# Altium project Can_Bus.PrjPcb
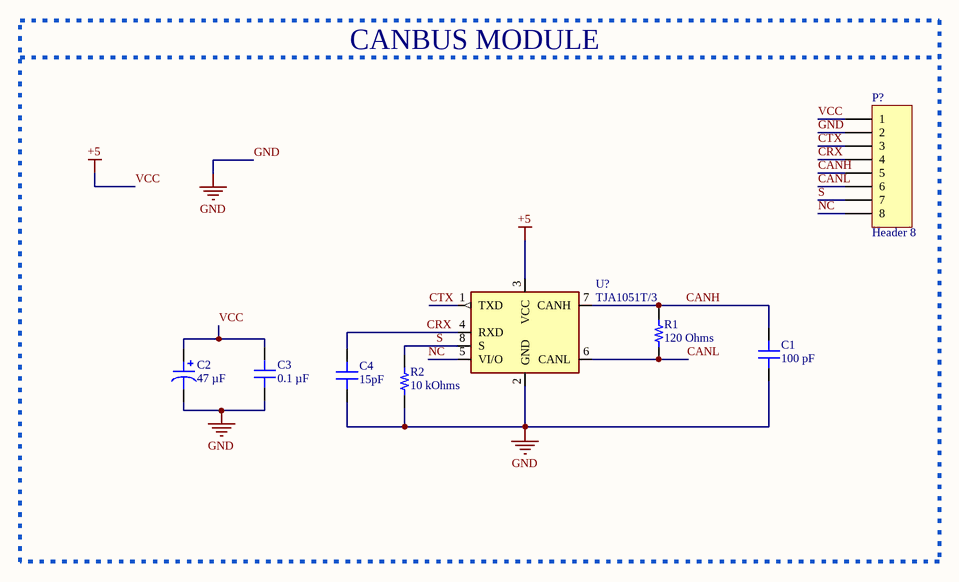
[diagram p0: Can_Bus.SchDoc]
1 sheet, 8 parts. Net scope: global (net labels, ports and power ports of the same name join across sheets).
Board file: Can_Bus.PcbDoc

## Sheet Can_Bus.SchDoc
size A4; SheetNumber: 1; SheetTotal: 1

### Parts
C1  100 pF  [CAP 0805_2012]
C2  47 µF  [CAP POL 1411_3528]
C3  0.1 µF  [CAP 0805_2012]
C4  15pF  [CAP 0805_2012]
P?  Header 8  [HDR1X8]
R1  120 Ohms  [RES 0805_2012]
R2  10 kOhms  [RES 0805_2012]
U?  TJA1051T/3  [SOT96-1]

### Blocks framed on the sheet
CANBUS MODULE: C1-C4 P? R1 R2 U?

### Nets
GND: C1.1 C2.2 C3.1 C4.1 P?.2 R2.1 U?.2(GND)
VCC: C2.1 C3.2 P?.1 U?.3(VCC)  [also labelled +5]
CANH: C1.2 P?.5 R1.2 U?.7(CANH)
CANL: P?.6 R1.1 U?.6(CANL)
CRX: C4.2 P?.4 U?.4(RXD)
CTX: P?.3 U?.1(TXD)
NC: P?.8 U?.5(VI/O)
S: P?.7 R2.2 U?.8(S)

### Library data of the parts
C1 = C0805C101J5HACAUTO: CAP CER 0805 100PF 50V ULTRA STA; manufacturer: KEMET; Temperature Coefficient: X8R; Tolerance: ±5%; Part Number: C0805C101J5HACAUTO; Value: 100 pF; Applications: Automotive; Capacitance: 100 pF; componentlink1description: Datasheet; componentlink1url: https://api.kemet.com/component-edge/download/datasheet/C0805C101J5HACAUTO.pdf; componentlink2description: DigiKey Link; componentlink2url: https://www.digikey.com/en/products/detail/kemet/C0805C101J5HACAUTO/7943626; Device Package: 0805 (2012 Metric); Features: Low ESL, High Temperature; lastupdated: 9.02.2024 20:16:09; Lifecycle Status: Active; Minimum Order: 1; Mounting Type: Surface Mount, MLCC; Operating Temperature: -55°C ~ 150°C; Package / Case: 0805 (2012 Metric); packaging: TapeAndReel; partid: 2585; Part Status: Active; price: 0.01; Ratings: AEC-Q200; series: SMD Auto X8R HT150C; Size / Dimension: 0.079" L x 0.049" W (2.00mm x 1.25mm); Supplier 1: DigiKey; Supplier Part Number 1: 399-16585-1-ND; Thickness (Max): 0.035" (0.88mm); Voltage - Rated: 50V
C2 = T494B476K010AT: CAP TANT 47UF 10% 10V 1411; manufacturer: KEMET; Manufacturer Size Code: B; ESR (Equivalent Series Resistance): 650mOhm @ 100kHz; Lifetime @ Temp.: 2000 Hrs @ 125°C; Type: Molded; Part Number: T494B476K010AT; Value: 47 µF; Capacitance: 47 µF; componentlink1description: Datasheet; componentlink1url: https://api.kemet.com/component-edge/download/datasheet/T494B476K010AT.pdf; componentlink2description: DigiKey Link; componentlink2url: https://www.digikey.com/en/products/detail/kemet/T494B476K010AT/9642205; Device Package: 1411 (3528 Metric); Features: General Purpose; Height - Seated (Max): 0.083" (2.10mm); lastupdated: 11.03.2024 07:26:11; Lifecycle Status: Active; Minimum Order: 1; Mounting Type: Surface Mount; Operating Temperature: -55°C ~ 125°C; Package / Case: 1411 (3528 Metric); packaging: TapeAndReel; partid: 3; Part Status: Active; price: 0.41; series: T494; Size / Dimension: 0.138" L x 0.110" W (3.50mm x 2.80mm); Supplier 1: DigiKey; Supplier Part Number 1: 399-18791-1-ND; Tolerance: ±10%; Voltage - Rated: 10 V
C3 = CC0805MRX7R9BB104: CAP CER 0.1UF 50V X7R 0805; manufacturer: Yageo; Tolerance: ±20%; Part Number: CC0805MRX7R9BB104; Value: 0.1 µF; Applications: General Purpose; Capacitance: 0.1 µF; componentlink1description: Datasheet; componentlink1url: https://www.yageo.com/upload/media/product/productsearch/datasheet/mlcc/UPY-GPHC_X7R_6.3V-to-50V_18.pdf; componentlink2description: DigiKey Link; componentlink2url: https://www.digikey.com/en/products/detail/yageo/CC0805MRX7R9BB104/5884281; Device Package: 0805 (2012 Metric); lastupdated: 9.02.2024 20:16:09; Lifecycle Status: Active; Minimum Order: 1; Mounting Type: Surface Mount, MLCC; Operating Temperature: -55°C ~ 125°C; Package / Case: 0805 (2012 Metric); packaging: TapeAndReel; partid: 2475; Part Status: Active; price: 0.01; series: CC; Size / Dimension: 0.079" L x 0.049" W (2.00mm x 1.25mm); Supplier 1: DigiKey; Supplier Part Number 1: 311-4351-1-ND; Temperature Coefficient: X7R; Thickness (Max): 0.037" (0.95mm); Voltage - Rated: 50V
C4 = 08055A150JAT2A: CAP CER 15PF 50V C0G/NP0 0805; Part Number: 08055A150JAT2A; Value: 15pF
P? = Header 8: Header, 8-Pin; LatestRevisionDate: 17-Jul-2002; LatestRevisionNote: Re-released for DXP Platform.; Publisher: Altium Limited
R1 = CRCW0805120RFKEAHP: RES SMD 120 OHM 1% 1/2W 0805; Manufacturer: Vishay Dale; Power (Watts): 0.5W, 1/2W; Temperature Coefficient: ±100ppm/°C; Part Number: CRCW0805120RFKEAHP; Value: 120 Ohms; ComponentLink1Description: Datasheet; ComponentLink1URL: http://www.vishay.com/docs/20043/crcwhpe3.pdf; ComponentLink2Description: DigiKey Link; ComponentLink2URL: https://www.digikey.com/en/products/detail/vishay-dale/CRCW0805120RFKEAHP/2226864; Composition: Thick Film; Device Package: 0805 (2012 Metric); Features: Automotive AEC-Q200, Pulse Withstanding; Height - Seated (Max): 0.020" (0.50mm); LastUpdated: 8.02.2024 21:02:28; Lifecycle Status: Active; Minimum Order: 1; Number of Terminations: 2; Operating Temperature: -55°C ~ 155°C; Package / Case: 0805 (2012 Metric); Packaging: TapeAndReel; PartId: 30328; Part Status: Active; Price: 0.02; Ratings: AEC-Q200; Resistance: 120 Ohms; Series: CRCW-HP; Size / Dimension: 0.079" L x 0.049" W (2.00mm x 1.25mm); Supplier 1: DigiKey; Supplier Part Number 1: 541-120TCT-ND; Supplier Device Package: 0805; Tolerance: ±1%
R2 = RNCS0805BKE10K0: RES 10K OHM 0.1% 1/10W 0805; Part Number: RNCS0805BKE10K0; Value: 10 kOhms
U? = TJA1051T/3: 1/1 ÐŸÑ€Ð¸ÐµÐ¼Ð¾Ð¿ÐµÑ€ÐµÐ´Ð°Ñ‚Ñ‡Ð¸Ðº ÐŸÐ¾Ð»Ð¾Ð²Ð¸Ð½Ð° CANbus 8-SO; MF: NXP USA; Price: None; Availability: In Stock; Purchase-URL: https://pricing.snapeda.com/search/part/TJA1051T/3/?ref=eda; SnapEDA_Link: https://www.snapeda.com/parts/TJA1051T/3/NXP+USA+Inc./view-part/?ref=snap; MP: TJA1051T/3; Value: *; Check_prices: https://www.snapeda.com/parts/TJA1051T/3/NXP+USA+Inc./view-part/?ref=eda; Package: SO-8 NXP Semiconductors